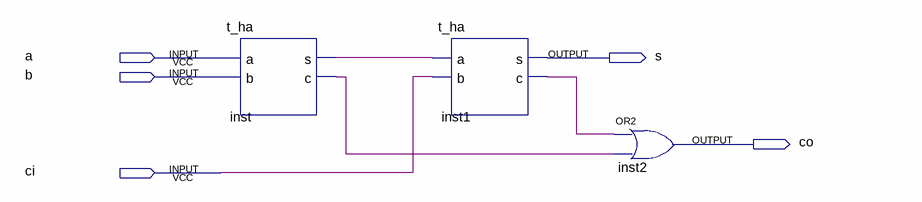
[diagram p0: schematic sheet]
// Quartus schematic t_fa.bdf as structural Verilog: 3 symbols, 5 pins
module t_fa (
  input  a,
  input  b,
  input  ci,
  output s,
  output co
);

  wire inst1_c, inst_c, inst_s;

  t_ha inst (.a(a), .b(b), .s(inst_s), .c(inst_c));
  t_ha inst1 (.a(inst_s), .b(ci), .s(s), .c(inst1_c));
  or inst2 (co, inst1_c, inst_c);
endmodule
